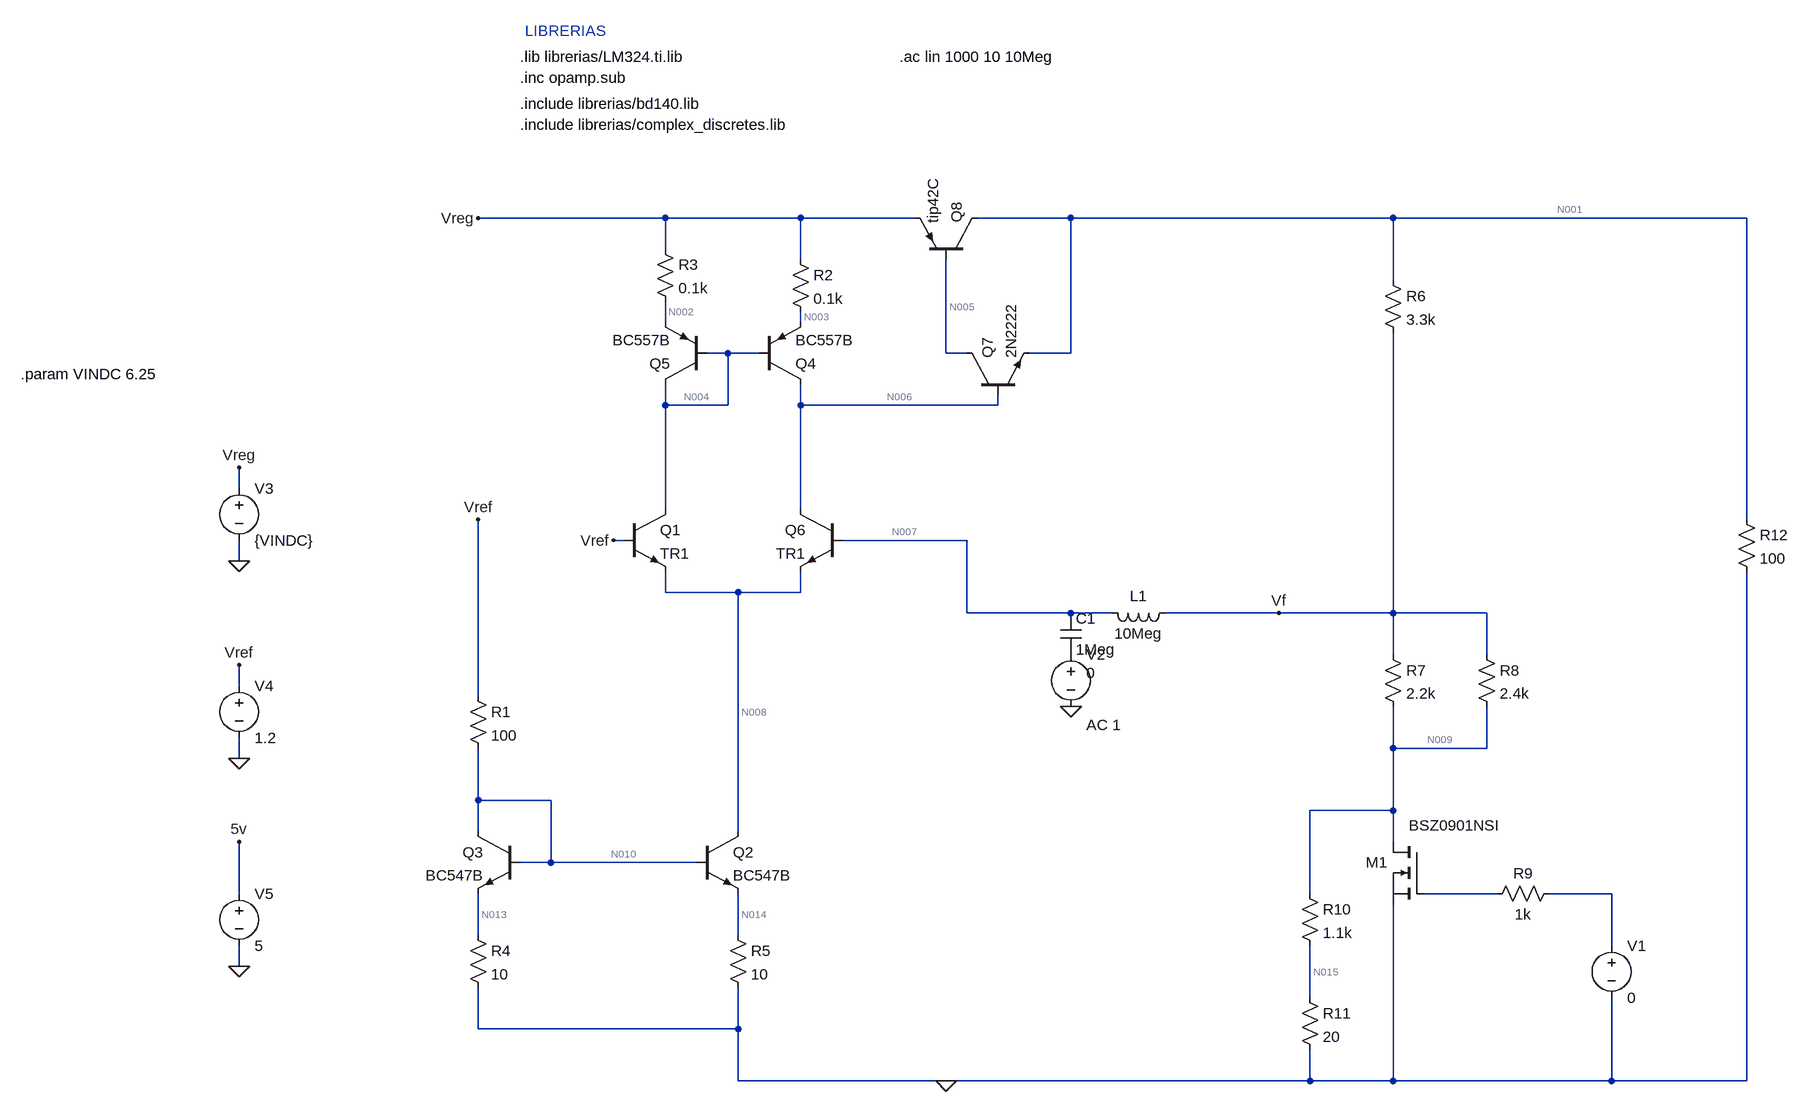
[diagram p0: schematic ganancia_de_lazo_B.asc]
ganancia_de_lazo_B.asc, the LTspice schematic file:
Version 4
SHEET 1 2040 884
WIRE 192 -464 -96 -464
WIRE 400 -464 192 -464
WIRE 576 -464 400 -464
WIRE 816 -464 672 -464
WIRE 1312 -464 816 -464
WIRE 1856 -464 1312 -464
WIRE 192 -416 192 -464
WIRE 400 -400 400 -464
WIRE 1312 -368 1312 -464
WIRE 192 -304 192 -336
WIRE 400 -304 400 -320
WIRE 288 -256 256 -256
WIRE 336 -256 288 -256
WIRE 624 -256 624 -400
WIRE 656 -256 624 -256
WIRE 816 -256 816 -464
WIRE 816 -256 752 -256
WIRE 192 -176 192 -208
WIRE 288 -176 288 -256
WIRE 288 -176 192 -176
WIRE 400 -176 400 -208
WIRE 704 -176 704 -192
WIRE 704 -176 400 -176
WIRE -464 -48 -464 -80
WIRE 192 -16 192 -176
WIRE 400 -16 400 -176
WIRE 1856 0 1856 -464
WIRE 128 32 112 32
WIRE 656 32 464 32
WIRE -464 64 -464 32
WIRE 192 112 192 80
WIRE 304 112 192 112
WIRE 400 112 400 80
WIRE 400 112 304 112
WIRE 656 144 656 32
WIRE 816 144 656 144
WIRE 880 144 816 144
WIRE 1136 144 960 144
WIRE 1312 144 1312 -288
WIRE 1312 144 1136 144
WIRE 1456 144 1312 144
WIRE 1312 208 1312 144
WIRE 1456 208 1456 144
WIRE -464 256 -464 224
WIRE -96 272 -96 0
WIRE 1312 352 1312 288
WIRE 1456 352 1456 288
WIRE 1456 352 1312 352
WIRE -464 368 -464 336
WIRE -96 432 -96 352
WIRE 16 432 -96 432
WIRE 1312 448 1312 352
WIRE 1312 448 1184 448
WIRE -96 480 -96 432
WIRE 304 480 304 112
WIRE 1312 496 1312 448
WIRE 16 528 16 432
WIRE 16 528 -32 528
WIRE 240 528 16 528
WIRE -464 576 -464 496
WIRE 1184 576 1184 448
WIRE 1472 576 1360 576
WIRE 1648 576 1552 576
WIRE -96 640 -96 576
WIRE 304 640 304 576
WIRE 1648 656 1648 576
WIRE -464 688 -464 656
WIRE 1184 736 1184 656
WIRE -96 784 -96 720
WIRE 304 784 304 720
WIRE 304 784 -96 784
WIRE 304 864 304 784
WIRE 624 864 304 864
WIRE 1184 864 1184 816
WIRE 1184 864 624 864
WIRE 1312 864 1312 592
WIRE 1312 864 1184 864
WIRE 1648 864 1648 736
WIRE 1648 864 1312 864
WIRE 1856 864 1856 80
WIRE 1856 864 1648 864
FLAG 112 32 Vref
FLAG 1136 144 Vf
FLAG 624 864 0
FLAG 816 288 0
FLAG -464 64 0
FLAG -464 368 0
FLAG -464 -80 Vreg
FLAG -464 224 Vref
FLAG -464 688 0
FLAG -464 496 5v
FLAG -96 -464 Vreg
FLAG -96 0 Vref
DATAFLAG 112 32 ""
DATAFLAG 400 -144 ""
DATAFLAG 192 -96 ""
SYMBOL npn 128 -16 R0
SYMATTR InstName Q1
SYMATTR Value TR1
SYMBOL npn 240 480 R0
SYMATTR InstName Q2
SYMATTR Value BC547B
SYMBOL npn -32 480 M0
SYMATTR InstName Q3
SYMATTR Value BC547B
SYMBOL res -112 256 R0
SYMATTR InstName R1
SYMATTR Value 100
SYMBOL res 384 -416 R0
SYMATTR InstName R2
SYMATTR Value 0.1k
SYMBOL res 176 -432 R0
SYMATTR InstName R3
SYMATTR Value 0.1k
SYMBOL pnp 336 -208 M180
SYMATTR InstName Q4
SYMATTR Value BC557B
SYMBOL pnp 256 -208 R180
SYMATTR InstName Q5
SYMATTR Value BC557B
SYMBOL npn 464 -16 M0
SYMATTR InstName Q6
SYMATTR Value TR1
SYMBOL res -112 624 R0
SYMATTR InstName R4
SYMATTR Value 10
SYMBOL res 288 624 R0
SYMATTR InstName R5
SYMATTR Value 10
SYMBOL res 1296 -384 R0
SYMATTR InstName R6
SYMATTR Value 3.3k
SYMBOL res 1296 192 R0
SYMATTR InstName R7
SYMATTR Value 2.2k
SYMBOL res 1440 192 R0
SYMATTR InstName R8
SYMATTR Value 2.4k
SYMBOL nmos 1360 496 M0
WINDOW 3 -116 -25 Left 2
SYMATTR Value BSZ0901NSI
SYMATTR InstName M1
SYMBOL res 1568 560 R90
WINDOW 0 0 56 VBottom 2
WINDOW 3 32 56 VTop 2
SYMATTR InstName R9
SYMATTR Value 1k
SYMBOL voltage 1648 640 R0
WINDOW 123 0 0 Left 0
WINDOW 39 0 0 Left 0
SYMATTR InstName V1
SYMATTR Value 0
SYMBOL res 1168 560 R0
SYMATTR InstName R10
SYMATTR Value 1.1k
SYMBOL res 1168 720 R0
SYMATTR InstName R11
SYMATTR Value 20
SYMBOL npn 656 -192 R270
SYMATTR InstName Q7
SYMATTR Value 2N2222
SYMBOL pnp 672 -400 M270
SYMATTR InstName Q8
SYMATTR Value tip42C
SYMBOL res 1840 -16 R0
SYMATTR InstName R12
SYMATTR Value 100
SYMBOL ind 976 128 R90
WINDOW 0 5 56 VBottom 2
WINDOW 3 32 56 VTop 2
SYMATTR InstName L1
SYMATTR Value 10Meg
SYMBOL cap 800 144 R0
SYMATTR InstName C1
SYMATTR Value 1Meg
SYMBOL voltage 816 192 R0
WINDOW 123 24 124 Left 2
WINDOW 39 0 0 Left 0
WINDOW 3 24 44 Left 2
SYMATTR Value2 AC 1
SYMATTR InstName V2
SYMATTR Value 0
SYMBOL voltage -464 -64 R0
WINDOW 123 0 0 Left 0
WINDOW 39 0 0 Left 0
SYMATTR InstName V3
SYMATTR Value {VINDC}
SYMBOL voltage -464 240 R0
WINDOW 123 0 0 Left 0
WINDOW 39 0 0 Left 0
SYMATTR InstName V4
SYMATTR Value 1.2
SYMBOL voltage -464 560 R0
WINDOW 123 0 0 Left 0
WINDOW 39 0 0 Left 0
SYMATTR InstName V5
SYMATTR Value 5
TEXT -32 -640 Left 2 !.include librerias/bd140.lib
TEXT -32 -680 Left 2 !.inc opamp.sub
TEXT -32 -712 Left 2 !.lib librerias/LM324.ti.lib
TEXT -24 -752 Left 2 ;LIBRERIAS
TEXT -32 -608 Left 2 !.include librerias/complex_discretes.lib
TEXT 552 -712 Left 2 !.ac lin 1000 10 10Meg
TEXT -800 -224 Left 2 !.param VINDC 6.25

The netlist it stands for:
* ganancia_de_lazo_B.asc
Q1 N004 Vref N008 0 TR1
Q2 N008 N010 N014 0 BC547B
Q3 N010 N010 N013 0 BC547B
R1 Vref N010 100
R2 Vreg N003 0.1k
R3 Vreg N002 0.1k
Q4 N006 N004 N003 0 BC557B
Q5 N004 N004 N002 0 BC557B
Q6 N006 N007 N008 0 TR1
R4 N013 0 10
R5 N014 0 10
R6 N001 Vf 3.3k
R7 Vf N009 2.2k
R8 Vf N009 2.4k
M1 N009 N011 0 0 BSZ0901NSI
R9 N012 N011 1k
V1 N012 0 0
R10 N009 N015 1.1k
R11 N015 0 20
Q7 N005 N006 N001 0 2N2222
Q8 N001 N005 Vreg 0 tip42C
R12 N001 0 100
L1 Vf N007 10Meg
C1 N007 P001 1Meg
V2 P001 0 0 AC 1
V3 Vreg 0 {VINDC}
V4 Vref 0 1.2
V5 5v 0 5
.model NPN NPN
.model PNP PNP
.lib standard.bjt
.model NMOS NMOS
.model PMOS PMOS
.lib standard.mos
.include librerias/bd140.lib
.inc opamp.sub
.lib librerias/LM324.ti.lib
* LIBRERIAS
.include librerias/complex_discretes.lib
.ac lin 1000 10 10Meg
.param VINDC 6.25
.backanno
.end

* Results of the author's LTspice run, read from the files saved beside the schematic
* Operating Point, zero values left out:
*   V(n004) = 5.368 V
*   V(vref) = 1.2 V
*   V(n008) = 541.3 mV
*   V(n010) = 728.7 mV
*   V(n014) = 46.91 mV
*   V(n013) = 46.96 mV
*   V(vreg) = 6.25 V
*   V(n003) = 6.016 V
*   V(n002) = 6.018 V
*   V(n006) = 3.598 V
*   V(n007) = 1.201 V
*   V(n001) = 2.976 V
*   V(vf) = 1.201 V
*   V(n009) = 592.9 mV
*   V(n015) = 10.59 mV
*   V(n005) = 5.556 V
*   V(5v) = 5 V
*   Ic(Q1) = 2.327 mA
*   Ib(Q1) = 7.246 µA
*   Ie(Q1) = -2.335 mA
*   Ic(Q6) = 2.332 mA
*   Ib(Q6) = 7.422 µA
*   Ie(Q6) = -2.34 mA
*   Ic(Q2) = 4.674 mA
*   Ib(Q2) = 17.03 µA
*   Ie(Q2) = -4.691 mA
*   Ic(Q3) = 4.679 mA
*   Ib(Q3) = 17 µA
*   Ie(Q3) = -4.696 mA
*   Ic(Q4) = -2.334 mA
*   Ib(Q4) = -6.7 µA
*   Ie(Q4) = 2.34 mA
*   Ic(Q5) = -2.313 mA
*   Ib(Q5) = -7.221 µA
*   Ie(Q5) = 2.321 mA
*   Ic(Q7) = 280.8 µA
*   Ib(Q7) = 1.378 µA
*   Ie(Q7) = -282.2 µA
*   Ic(Q8) = -30.02 mA
*   Ib(Q8) = -280.8 µA
*   Ie(Q8) = 30.3 mA
*   Id(M1) = 31.33 nA
*   Ig(M1) = -629 pA
*   Is(M1) = -30.7 nA
*   I(C1) = 1.201 µA
*   I(L1) = 8.623 µA
*   I(R1) = 4.713 mA
*   I(R2) = 2.34 mA
*   I(R3) = 2.321 mA
*   I(R4) = 4.696 mA
*   I(R5) = 4.691 mA
*   I(R6) = 538.1 µA
*   I(R7) = 276.2 µA
*   I(R8) = 253.2 µA
*   I(R10) = 529.4 µA
*   I(R11) = 529.4 µA
*   I(R12) = 29.76 mA
*   I(V2) = 1.201 µA
*   I(V3) = -34.96 mA
*   I(V4) = -4.721 mA